# Altium schematic sheet other.SchDoc
size 213 x 93 mm; SheetNumber: 4; SheetTotal: 4
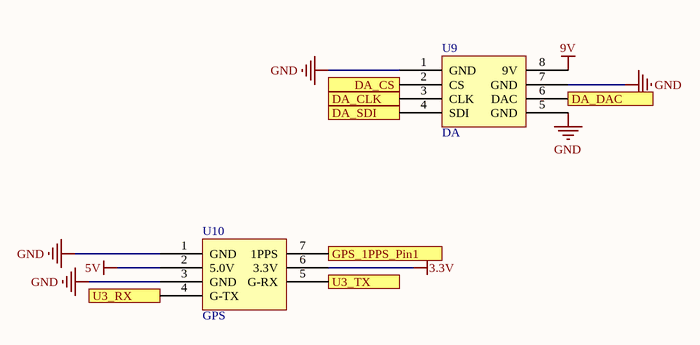
[diagram p0: other.SchDoc]

## Parts
U9  DA  [DA]
U10  GPS  [GPS]

## Ports
DA_CLK (in), DA_CS (in), DA_DAC (out), DA_SDI (in), GPS_1PPS_Pin1 (out), U3_RX (out), U3_TX (in)

## Nets
3.3V: U10.6(3.3V)
5V: U10.2(5.0V)
9V: U9.8(9V)
GND: U9.1(GND) U9.5(GND) U9.7(GND) U10.1(GND) U10.3(GND)
DA_CLK: U9.3(CLK) ; port DA_CLK
DA_CS: U9.2(CS) ; port DA_CS
DA_DAC: U9.6(DAC) ; port DA_DAC
DA_SDI: U9.4(SDI) ; port DA_SDI
GPS_1PPS_Pin1: U10.7(1PPS) ; port GPS_1PPS_Pin1
U3_RX: U10.4(G-TX) ; port U3_RX
U3_TX: U10.5(G-RX) ; port U3_TX